# EAGLE design driver2 (EAGLE 7.2.0)
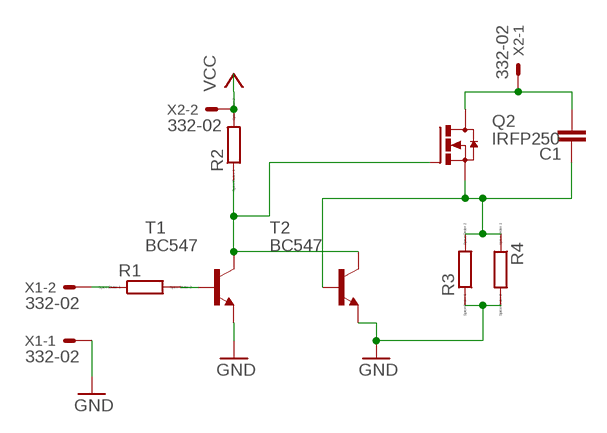
[diagram p0: schematic, sheet 1]

## Parts
C1  C-EU025-025X050  [C025-025X050]
Q2  IRFP250  [TO-247AD-V]
R1  R0204/7  [0204/7]
R2  R0204/7  [0204/7]
R3  R0204/7  [0204/7]
R4  R0204/7  [0204/7]
T1  BC547  [TO92]
T2  BC547  [TO92]
X1  332-02  [332-02]
X2  332-02  [332-02]

## Nets
GND: R3.1 R4.2 T1.1(E) T2.1(E) X1.1
N$1: R1.1 X1.2
N$2: R1.2 T1.2(B)
N$3: Q2.G R2.1 T1.3(C) T2.3(C)
N$5: C1.2 Q2.D X2.1
N$6: C1.1 Q2.S R3.2 R4.1 T2.2(B)
VCC: R2.2 X2.2

## Library data of the parts
C1 = rcl:C-EU: CAPACITOR, European symbol
Q2 = transistor-power:IRFP25*: 33A/27A, 200V/150V, 0.085/0.012 Ohm, N-Channel Power MOSFET Source: Fairchild Semiconductor Corporation
R1-R4 = eagle-ltspice:R: RESISTOR, European symbol; SPICEMODEL: NONE; SPICEPREFIX: R
T1 T2 = transistor:BC547: NPN TRANSISTOR
X1 X2 = con-garry:332-02: 2 Pin - 2mm Dual Row Source: www.mpe-connector.de / garry_shortform_2012.pdf

## Board
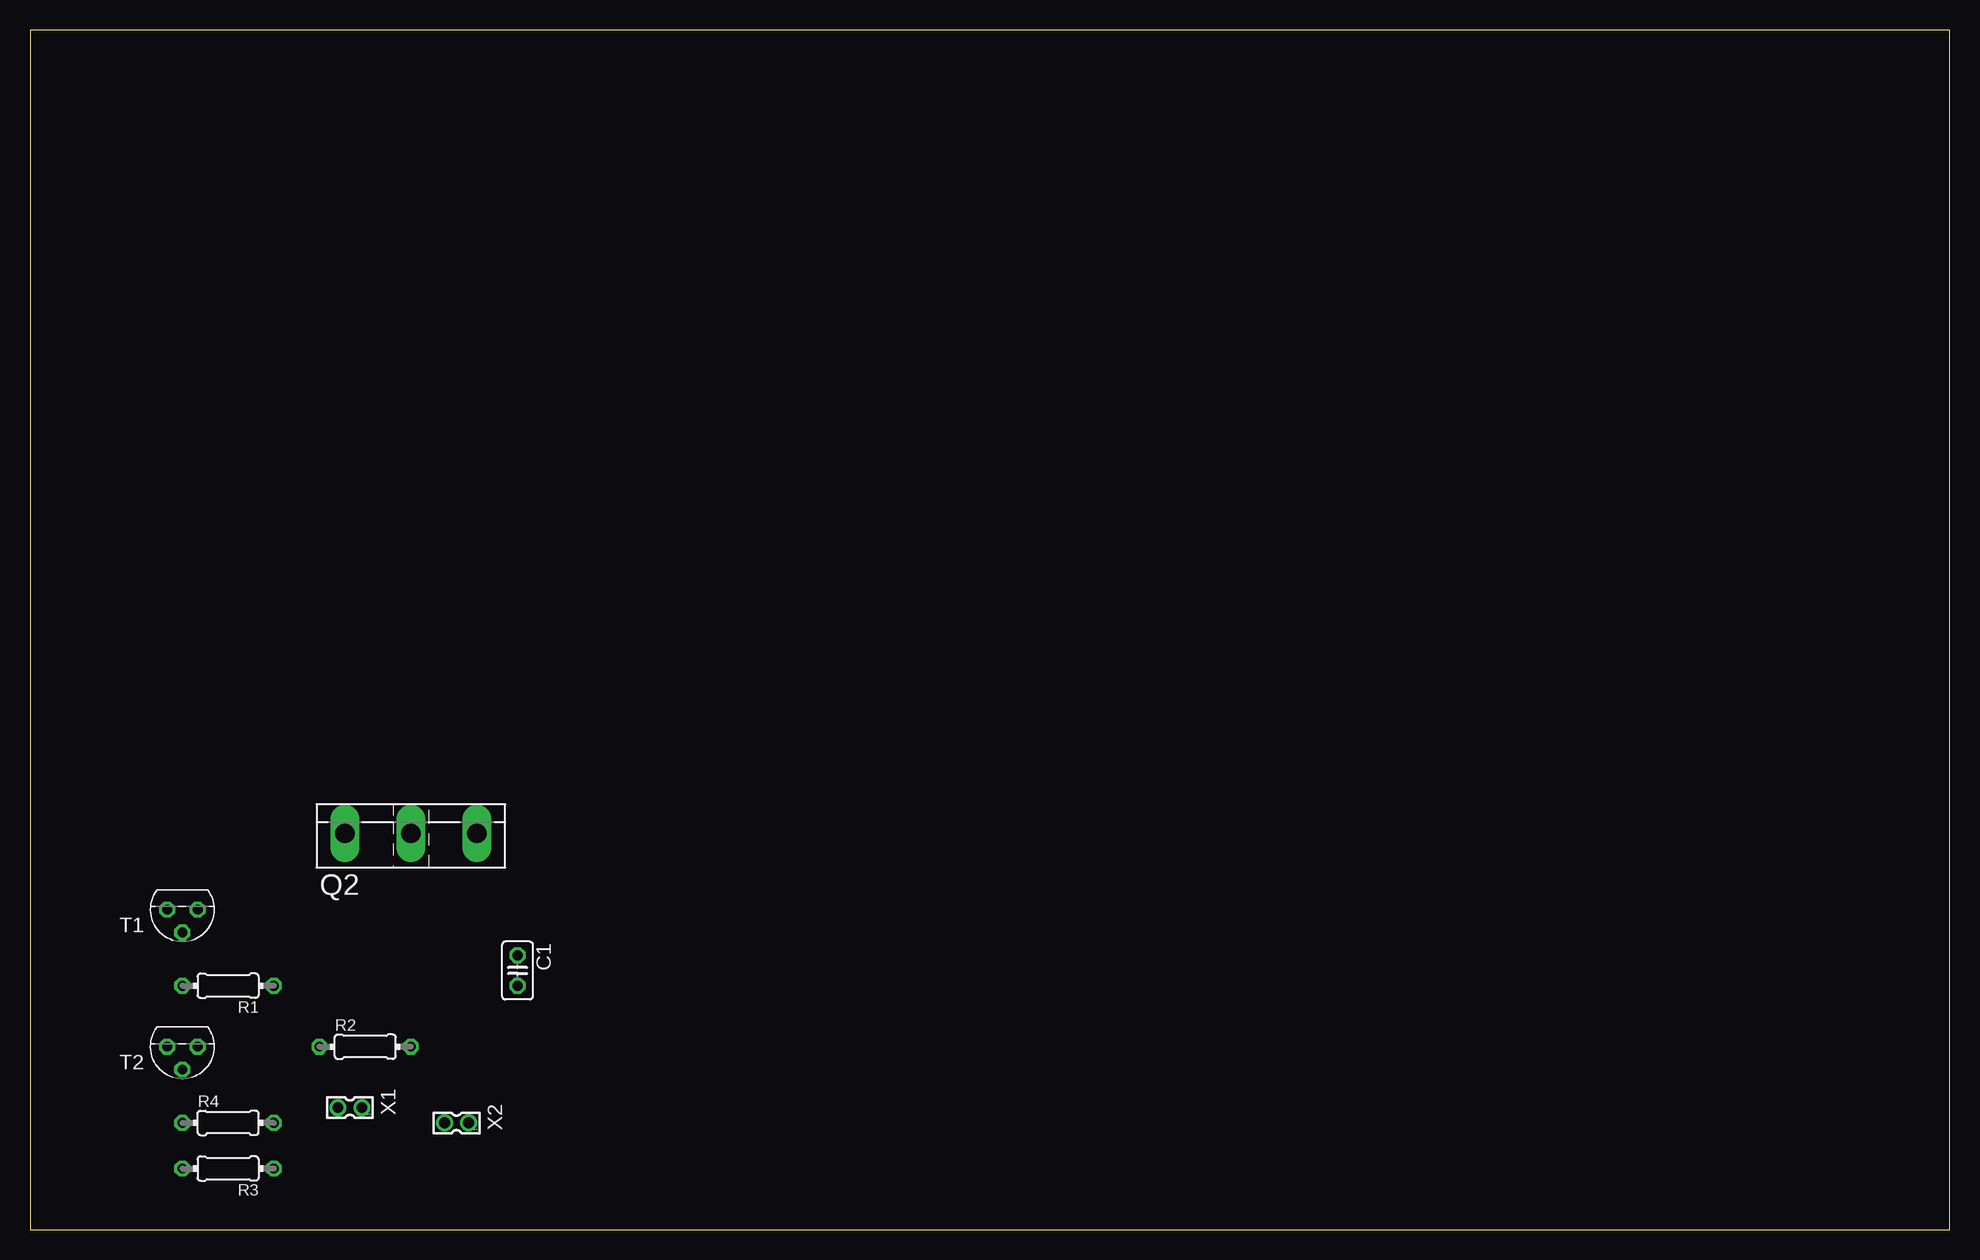
[diagram p1: board, top side]
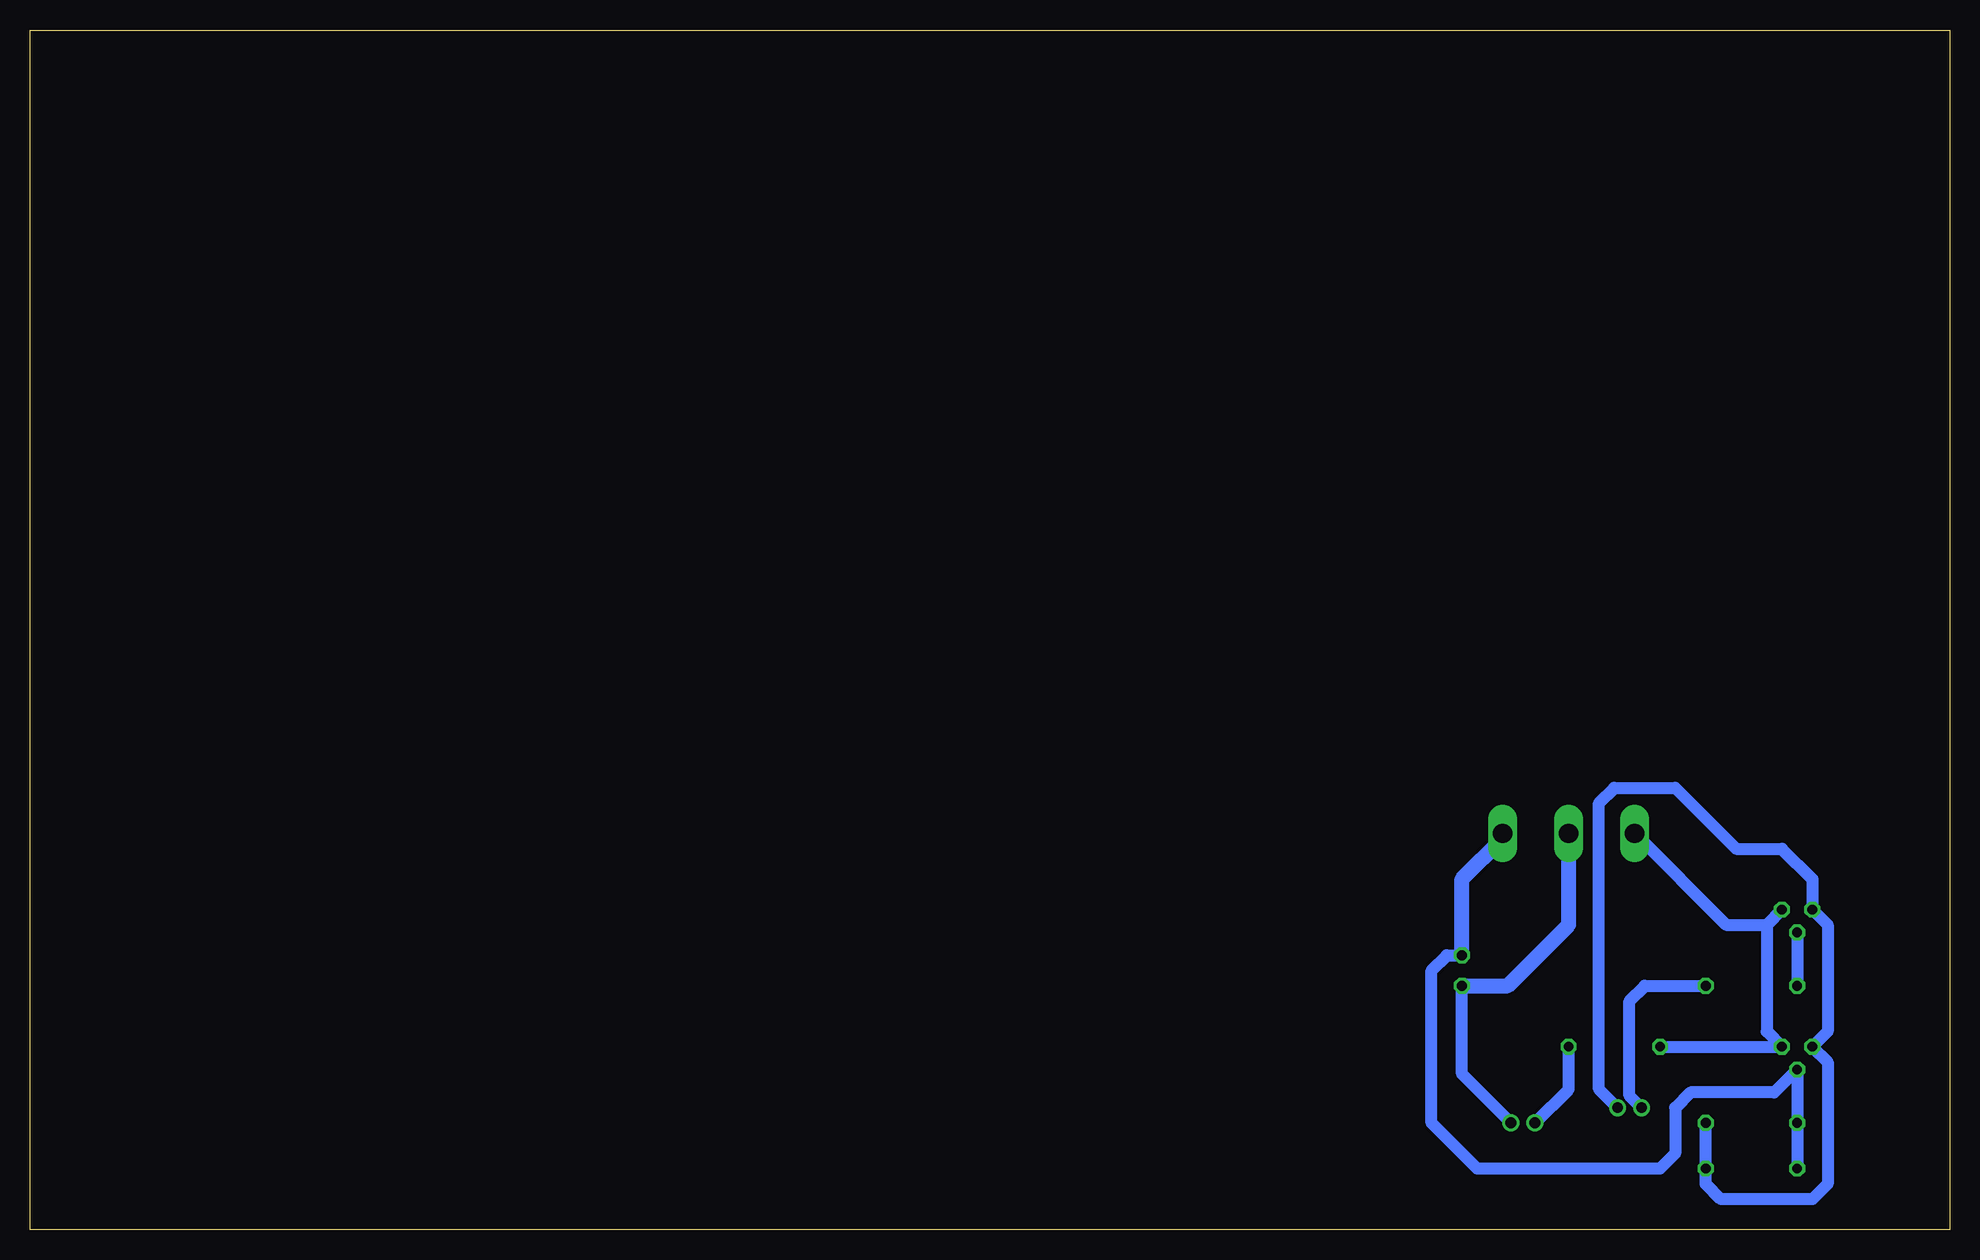
[diagram p2: board, bottom side, seen from below]

Size 160 x 100 mm. Coordinates in mm from the lower left corner, seen from the top.
Outline: 0,0 160,0 160,100 0,100 0,0
Copper layers (1*16): Top 0.035mm / dielectric 1.5mm / Bottom 0.035mm
Design rules "default": minimum track width 10mil, minimum drill 24mil, track to track 8mil, track to pad 8mil, pad to pad 8mil, via to via 8mil, smd to smd 8mil, copper to edge 40mil, drill to drill 8mil, minimum pad ring 10mil, minimum via ring 8mil, stop-mask expansion 4mil, vias tented up to drill 0mil, thermal gap 10mil

### Footprints (pad centres in the part's own frame; a part is rotated, then mirrored left to right if it is on the bottom)
C025-025X050 = drill 0.813 octagon: 1 -1.27,0; 2 1.27,0
TO-247AD-V = drill 1.6 long: D 0,-2.54; G -5.5,-2.54; S 5.5,-2.54
0204/7 = drill 0.813 octagon: 1 -3.81,0; 2 3.81,0
TO92 = drill 0.813 octagon: 1 1.27,0; 2 0,1.905; 3 -1.27,0
332-02 = drill 0.9 pad 1.27: 1 0,-1; 2 0,1

### Placement (x,y rotation side)
C1  40.64,21.59 270 top
Q2  31.75,35.56 0 top
R1  16.51,20.32 180 top
R2  27.94,15.24 0 top
R3  16.51,5.08 180 top
R4  16.51,8.89 0 top
T1  12.7,26.67 180 top
T2  12.7,15.24 180 top
X1  26.67,10.16 90 top
X2  35.56,8.89 90 top

### Tracks (layer width: path | path; a pad name or v marks a point on that pad's centre or on a via)
GND
  Bottom 1.016: X1.1 29.21,11.7 29.21,35.56 27.94,36.83 22.86,36.83 17.78,31.75 13.97,31.75 11.43,29.21 T1.1 10.16,25.4 10.16,16.51 T2.1 10.16,13.97 10.16,3.81 11.43,2.54 19.05,2.54 20.32,3.81 R3.1 R4.2
N$1
  Bottom 1.016: X1.2 26.67,11.16 26.67,19.05 25.4,20.32 R1.1
N$2
  Bottom 1.016: T1.2 R1.2
N$3
  Bottom 1.016: T1.3 15.24,25.4 | 15.24,25.4 15.24,16.51 T2.3 R2.1 | Q2.G 18.63,25.4 15.24,25.4
N$5
  Bottom 1.016: X2.1 40.64,12.97 C1.2
  Bottom 1.27: C1.2 36.83,20.32 31.75,25.4 Q2.D
N$6
  Bottom 1.016: R3.2 R4.1 T2.2 14.61,11.43 21.59,11.43 22.86,10.16 22.86,6.35 24.13,5.08 39.37,5.08 43.18,8.89 43.18,21.59 41.91,22.86 C1.1
  Bottom 1.27: C1.1 40.64,29.21 37.25,32.6 Q2.S
VCC
  Bottom 1.016: X2.2 31.75,11.7 R2.2